# Altium schematic sheet Sheet1_Project.SchDoc: ESP 32 to MPU 6050 Connection
size 152 x 114 mm
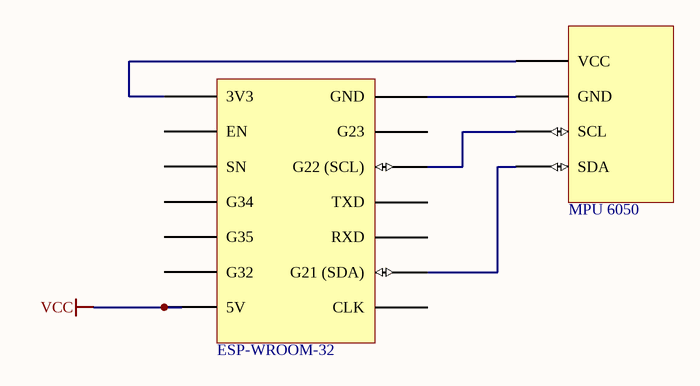
[diagram p0: Sheet1_Project.SchDoc]

## Parts
*  MPU 6050
U?  ESP-WROOM-32

## Nets
VCC: U?.7(5V)
Net*_1: *.1(VCC) U?.1(3V3)
Net*_2: *.2(GND) U?.8(GND)
Net*_3: *.3(SCL) U?.10(G22_(SCL))
Net*_4: *.4(SDA) U?.13(G21_(SDA))

Not connected (* = marked no-connect by the designer): U? 2(EN) 3(SN) 4(G34) 5(G35) 6(G32) 9(G23) 11(TXD) 12(RXD) 14(CLK)

## Library data of the parts
* = MPU 6050: Accelerometer; ComponentLink1Description: Pin-Out; ComponentLink1URL: https://www.google.com/search?sca_esv=709dfd0b212bea1b&sxsrf=AE3TifMR7yj9DkOf6VE1uazJXZg8ymAUcA:1766248350080&udm=2&fbs=AIIjpHxU7SXXniUZfeShr2fp4giZ1Y6MJ25_tmWITc7uy4KIeioyp3OhN11EY0n5qfq-zEMZldv_eRjZ2XLYc5GnVnME7glWodDcaQwvGYJtospyF4hao4VocMoniUVvlzzwRcB_gh46MHhrDPH5NOVwPivjadeakFm05zxnpGxC0pvMBL6-v6zKyyE5nBk0bvDg1EPDxHf7xVk4s29Sxnujftn4liXpkA&q=pin+description+of+ESP-WROOM-32&sa=X&ved=2ahUKEwiulffry8yRAxXdMlkFHdgdNvwQtKgLegQIFhAB&biw=1681&bih=814&dpr=1.14#sv=CAMSVhoyKhBlLW5hZV93S1diNTRCaGZNMg5uYWVfd0tXYjU0QmhmTToOSkJyMUtrUXRwSnN3aE0gBCocCgZtb3NhaWMSEGUtbmFlX3dLV2I1NEJoZk0YADABGAcg54KHwQMwAkoKCAIQAhgCIAIoAg
U? = ESP-WROOM-32: ESP32 Wifi + Bluetooth; ComponentLink1Description: Pin-Out; ComponentLink1URL: https://www.google.com/search?sca_esv=709dfd0b212bea1b&sxsrf=AE3TifMR7yj9DkOf6VE1uazJXZg8ymAUcA:1766248350080&udm=2&fbs=AIIjpHxU7SXXniUZfeShr2fp4giZ1Y6MJ25_tmWITc7uy4KIeioyp3OhN11EY0n5qfq-zEMZldv_eRjZ2XLYc5GnVnME7glWodDcaQwvGYJtospyF4hao4VocMoniUVvlzzwRcB_gh46MHhrDPH5NOVwPivjadeakFm05zxnpGxC0pvMBL6-v6zKyyE5nBk0bvDg1EPDxHf7xVk4s29Sxnujftn4liXpkA&q=pin+description+of+ESP-WROOM-32&sa=X&ved=2ahUKEwiulffry8yRAxXdMlkFHdgdNvwQtKgLegQIFhAB&biw=1681&bih=814&dpr=1.14#sv=CAMSVhoyKhBlLW5hZV93S1diNTRCaGZNMg5uYWVfd0tXYjU0QmhmTToOSkJyMUtrUXRwSnN3aE0gBCocCgZtb3NhaWMSEGUtbmFlX3dLV2I1NEJoZk0YADABGAcg54KHwQMwAkoKCAIQAhgCIAIoAg